# Altium schematic sheet FreidoraAireCuki.SchDoc: Freidora Aire Cuki
size A3; Author: Marianito; CompanyName: Marianito INC; DrawnBy: Marianito; Engineer: Marianito; PageSetup: Record=PageOptions|CenterHorizontal=True|CenterVertical=True|PrintScale=0.73|XCorrection=1.00|YCorrection=1.00|PrintKind=0|BorderSize=5000000|LeftOffset=0|BottomOffset=0|Orientation=2|PaperLength=1000|PaperWidth=1000|Scale=100|PaperSource=7|PrintQuality=-4|MediaType=1|DitherType=10|PrintScaleMode=1|PaperKind=A4; ProjectName: Freidora Aire Cuki
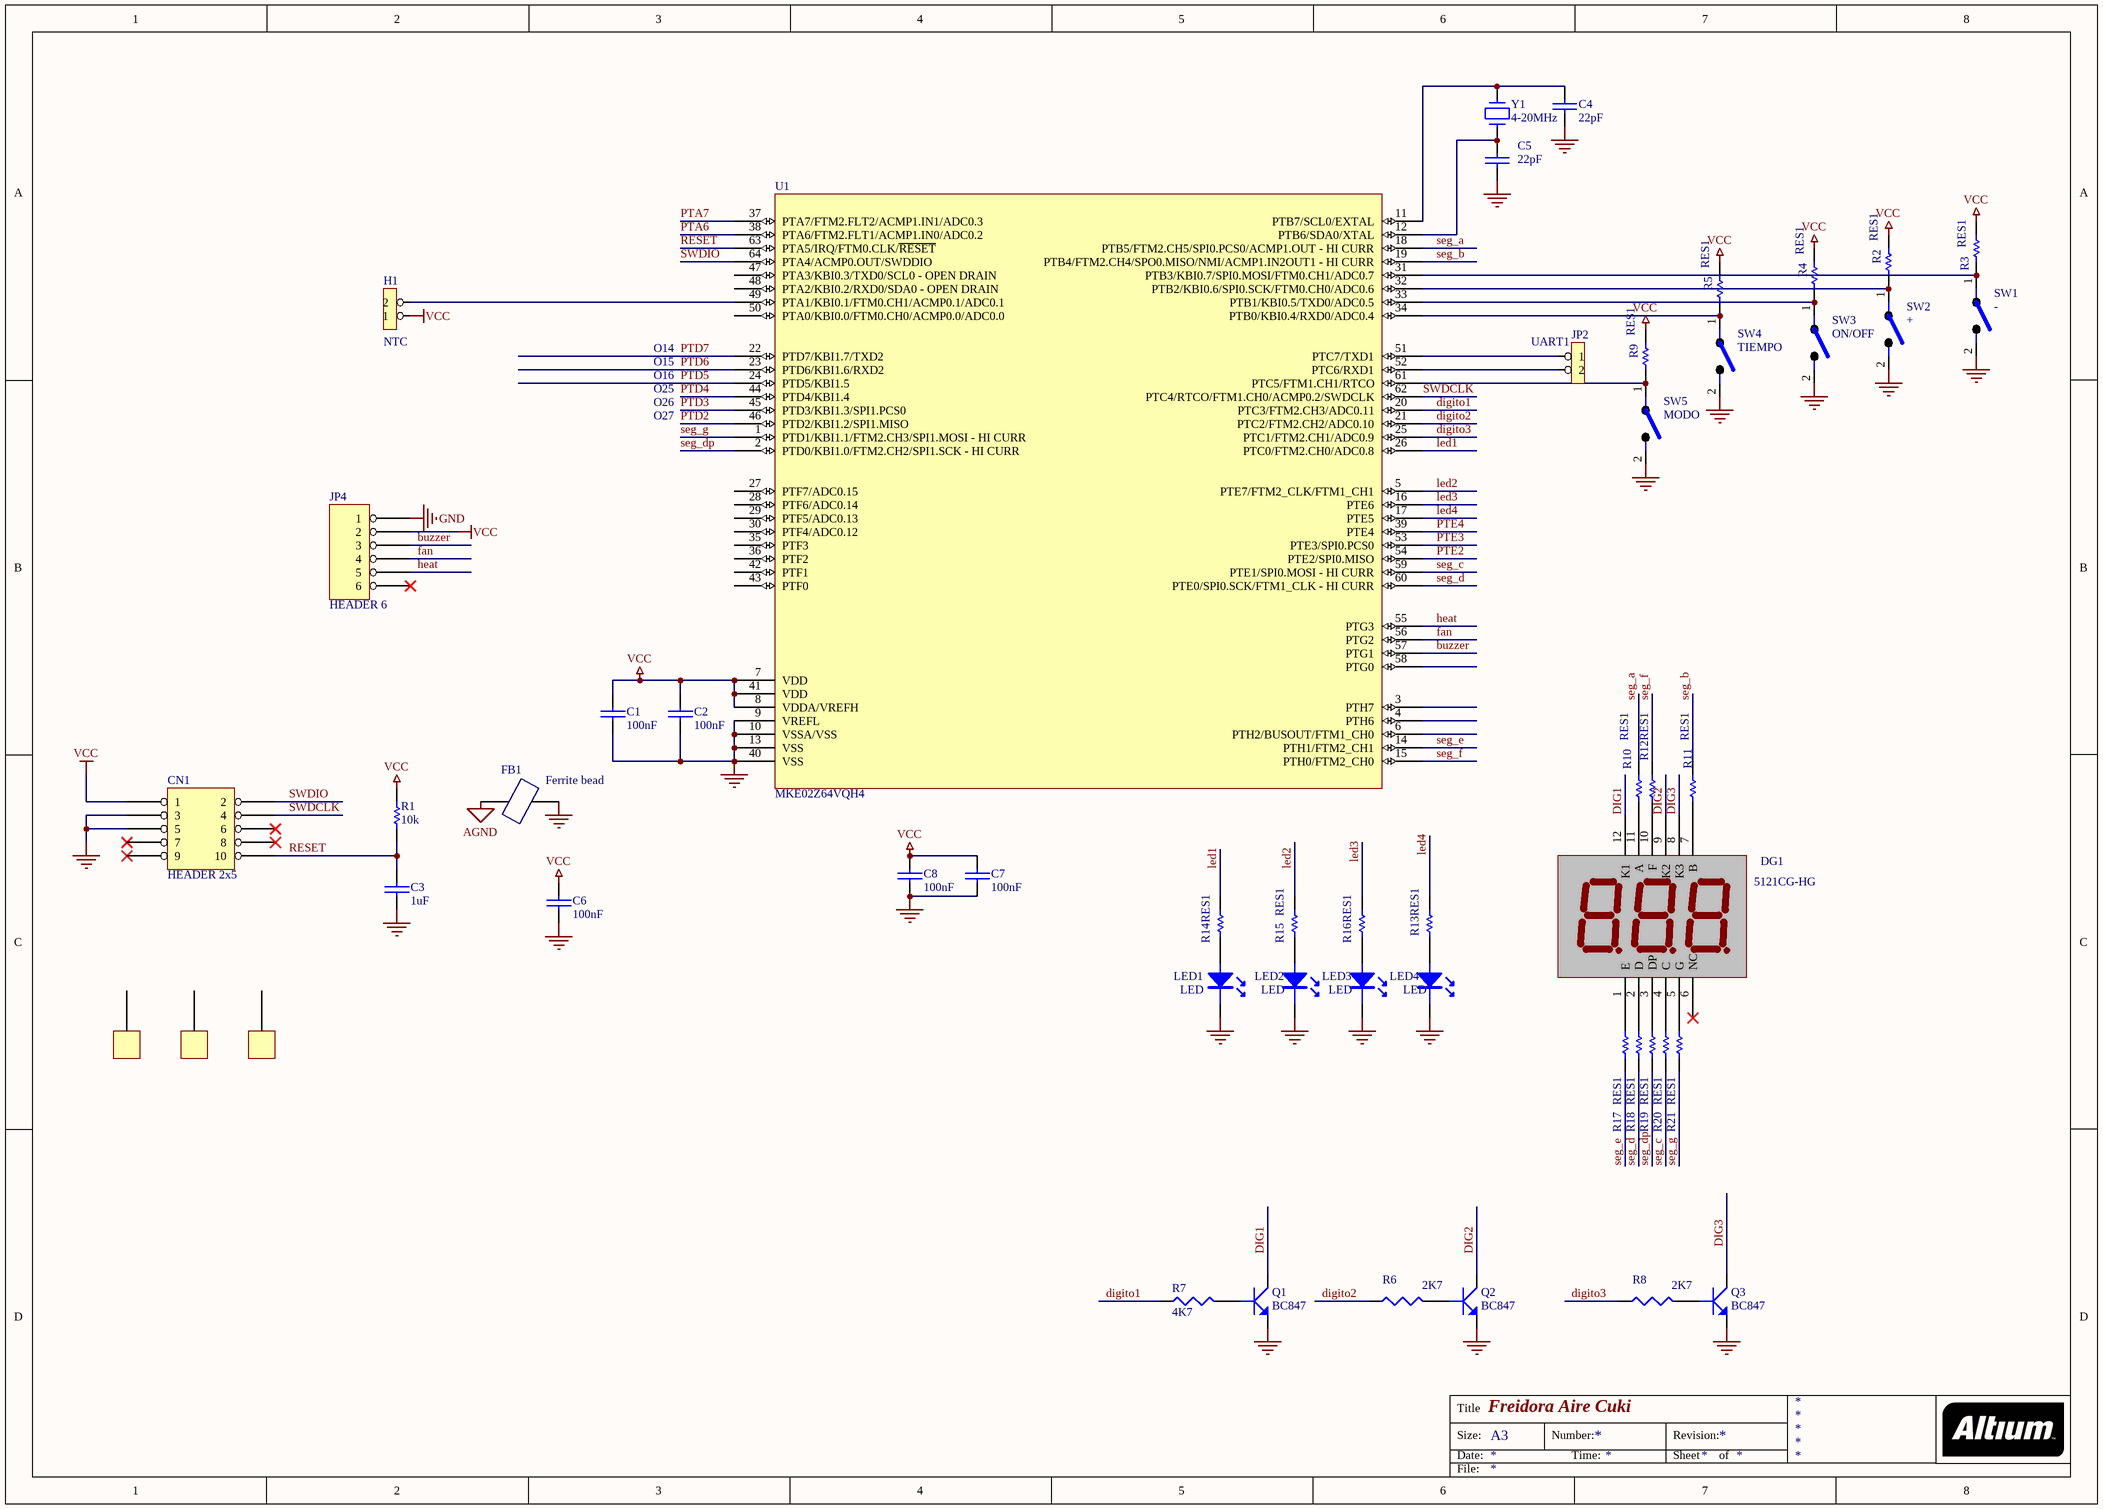
[diagram p0: FreidoraAireCuki.SchDoc]

## Parts
C1  100nF  [C-0805_N]
C2  100nF  [C-0805_N]
C3  1uF  [C-0805_N]
C4  22pF  [C-0805_N]
C5  22pF  [C-0805_N]
C6  100nF  [C-0805_N]
C7  100nF  [C-0805_N]
C8  100nF  [C-0805_N]
CN1  HEADER 2x5  [SIP2X5]
DG1  5121CG-HG  [DIGIT_3_400]
FB1  Ferrite bead  [C-0805_N]
H1  NTC  [SIP2]
JP2  UART1  [SIP2]
JP4  HEADER 6  [SIP6]
LED1  LED  [LED3MM]
LED2  LED  [LED3MM]
LED3  LED  [LED3MM]
LED4  LED  [LED3MM]
Q1  BC847  [SOT23_BOTTOM]
Q2  BC847  [SOT23_BOTTOM]
Q3  BC847  [SOT23_BOTTOM]
R1  10k  [R-0805_N_WAVE]
R2  RES1  [0805BOTTOM]
R3  RES1  [0805BOTTOM]
R4  RES1  [0805BOTTOM]
R5  RES1  [0805BOTTOM]
R6  2K7  [R-0805_N_WAVE]
R7  4K7  [R-0805_N_WAVE]
R8  2K7  [R-0805_N_WAVE]
R9  RES1  [0805BOTTOM]
R10  RES1  [0805BOTTOM]
R11  RES1  [0805BOTTOM]
R12  RES1  [0805BOTTOM]
R13  RES1  [0805BOTTOM]
R14  RES1  [0805BOTTOM]
R15  RES1  [0805BOTTOM]
R16  RES1  [0805BOTTOM]
R17  RES1  [0805BOTTOM]
R18  RES1  [0805BOTTOM]
R19  RES1  [0805BOTTOM]
R20  RES1  [0805BOTTOM]
R21  RES1  [0805BOTTOM]
SW1  -  [ZIPPY-TS]
SW2  +  [ZIPPY-TS]
SW3  ON/OFF  [ZIPPY-TS]
SW4  TIEMPO  [ZIPPY-TS]
SW5  MODO  [ZIPPY-TS]
TORR1  (no value)  [TORRETA]
TORR2  (no value)  [TORRETA]
TORR3  (no value)  [TORRETA]
U1  MKE02Z64VQH4  [QFP64]
Y1  4-20MHz  [XTAL1]

## Nets
AGND: FB1.2
GND: C1.2 C2.2 C3.2 C4.1 C5.1 C6.2 C7.2 C8.2 CN1.3 CN1.5 FB1.1 JP4.1 LED1.2(K) LED2.2(K) LED3.2(K) LED4.2(K) Q1.2(E) Q2.2(E) Q3.2(E) SW1.2 SW2.2 SW3.2 SW4.2 SW5.2 U1.9(VREFL) U1.10(VSSA/VSS) U1.13(VSS) U1.40(VSS)
VCC: C1.1 C2.1 C6.1 C7.1 C8.1 CN1.1 H1.1 JP4.2 R1.2 R2.2 R3.2 R4.2 R5.2 R9.2 U1.7(VDD) U1.8(VDDA/VREFH) U1.41(VDD)
buzzer: JP4.3 U1.57(PTG1)
DIG1: DG1.12(K1) Q1.3(C)
DIG2: DG1.9(K2) Q2.3(C)
DIG3: DG1.8(K3) Q3.3(C)
digito1: R7.1 U1.20(PTC3/FTM2.CH3/ADC0.11)
digito2: R6.1 U1.21(PTC2/FTM2.CH2/ADC0.10)
digito3: R8.1 U1.25(PTC1/FTM2.CH1/ADC0.9)
fan: JP4.4 U1.56(PTG2)
heat: JP4.5 U1.55(PTG3)
led1: R14.2 U1.26(PTC0/FTM2.CH0/ADC0.8)
led2: R15.2 U1.5(PTE7/FTM2_CLK/FTM1_CH1)
led3: R16.2 U1.16(PTE6)
led4: R13.2 U1.17(PTE5)
PTA6: U1.38(PTA6/FTM2.FLT1/ACMP1.IN0/ADC0.2)
PTA7: U1.37(PTA7/FTM2.FLT2/ACMP1.IN1/ADC0.3)
PTD2: U1.46(PTD2/KBI1.2/SPI1.MISO)
PTD3: U1.45(PTD3/KBI1.3/SPI1.PCS0)
PTD4: U1.44(PTD4/KBI1.4)
PTD5: U1.24(PTD5/KBI1.5)
PTD6: U1.23(PTD6/KBI1.6/RXD2)
PTD7: U1.22(PTD7/KBI1.7/TXD2)
PTE2: U1.54(PTE2/SPI0.MISO)
PTE3: U1.53(PTE3/SPI0.PCS0)
PTE4: U1.39(PTE4)
RESET: C3.1 CN1.10 R1.1 U1.63(PTA5/IRQ/FTM0.CLK/~{RESET})
seg_a: R10.2 U1.18(PTB5/FTM2.CH5/SPI0.PCS0/ACMP1.OUT_-_HI_CURR)
seg_b: R11.2 U1.19(PTB4/FTM2.CH4/SPO0.MISO/NMI/ACMP1.IN2OUT1_-_HI_CURR)
seg_c: R20.1 U1.59(PTE1/SPI0.MOSI_-_HI_CURR)
seg_d: R18.1 U1.60(PTE0/SPI0.SCK/FTM1_CLK_-_HI_CURR)
seg_dp: R19.1 U1.2(PTD0/KBI1.0/FTM2.CH2/SPI1.SCK_-_HI_CURR)
seg_e: R17.1 U1.14(PTH1/FTM2_CH1)
seg_f: R12.2 U1.15(PTH0/FTM2_CH0)
seg_g: R21.1 U1.1(PTD1/KBI1.1/FTM2.CH3/SPI1.MOSI_-_HI_CURR)
SWDCLK: CN1.4 U1.62(PTC4/RTCO/FTM1.CH0/ACMP0.2/SWDCLK)
SWDIO: CN1.2 U1.64(PTA4/ACMP0.OUT/SWDDIO)
NetC4_2: C4.2 U1.11(PTB7/SCL0/EXTAL) Y1.1
NetC5_2: C5.2 U1.12(PTB6/SDA0/XTAL) Y1.2
NetDG1_1: DG1.1(E) R17.2
NetDG1_2: DG1.2(D) R18.2
NetDG1_3: DG1.3(DP) R19.2
NetDG1_4: DG1.4(C) R20.2
NetDG1_5: DG1.5(G) R21.2
NetDG1_7: DG1.7(B) R11.1
NetDG1_10: DG1.10(F) R12.1
NetDG1_11: DG1.11(A) R10.1
NetH1_2: H1.2 U1.49(PTA1/KBI0.1/FTM0.CH1/ACMP0.1/ADC0.1)
NetJP2_1: JP2.1 U1.51(PTC7/TXD1)
NetJP2_2: JP2.2 U1.52(PTC6/RXD1)
NetLED1_1: LED1.1(A) R14.1
NetLED2_1: LED2.1(A) R15.1
NetLED3_1: LED3.1(A) R16.1
NetLED4_1: LED4.1(A) R13.1
NetQ1_1: Q1.1(B) R7.2
NetQ2_1: Q2.1(B) R6.2
NetQ3_1: Q3.1(B) R8.2
NetR2_1: R2.1 SW2.1 U1.32(PTB2/KBI0.6/SPI0.SCK/FTM0.CH0/ADC0.6)
NetR3_1: R3.1 SW1.1 U1.31(PTB3/KBI0.7/SPI0.MOSI/FTM0.CH1/ADC0.7)
NetR4_1: R4.1 SW3.1 U1.33(PTB1/KBI0.5/TXD0/ADC0.5)
NetR5_1: R5.1 SW4.1 U1.34(PTB0/KBI0.4/RXD0/ADC0.4)
NetR9_1: R9.1 SW5.1 U1.61(PTC5/FTM1.CH1/RTCO)

Not connected (* = marked no-connect by the designer): CN1 6* 7* 8* 9*; DG1 6(NC)*; JP4 6*; TORR1 0; TORR2 0; TORR3 0; U1 3(PTH7) 4(PTH6) 6(PTH2/BUSOUT/FTM1_CH0) 27(PTF7/ADC0.15) 28(PTF6/ADC0.14) 29(PTF5/ADC0.13) 30(PTF4/ADC0.12) 35(PTF3) 36(PTF2) 42(PTF1) 43(PTF0) 47(PTA3/KBI0.3/TXD0/SCL0_-_OPEN_DRAIN) 48(PTA2/KBI0.2/RXD0/SDA0_-_OPEN_DRAIN) 50(PTA0/KBI0.0/FTM0.CH0/ACMP0.0/ADC0.0) 58(PTG0)

## Notes on the sheet
- O14
- O15
- O16
- O25
- O26
- O27
- Title
- Size:
- Date:
- A3
- Number:
- Time:
- Revision:
- Sheet
- of
- File:

## Library data of the parts
C1 C2 C6-C8 = CAP: Non polarized capacitor; Value: 100nF
  C1 C2 C6 C8: Price: 0,022
C3-C5 = CAP: Non polarized capacitor; Value: 100nF
CN1 = HEADER 5X2
DG1 = DIGITO x 3 400: Dígito 0.52' cátodo común verde
H1 JP2 = HEADER 2: Text Field1: 0,006
LED1-LED4 = LED: Text Field1: 0,04
Q1-Q3 = BC847: NPN transistor bipolar
R1 = Res SMD 0805: Resistor SMD 0805; Precio Deksor: 0.00; Value: 1k; Published: 8-Jun-2000; LatestRevisionDate: 17-Jul-2002; LatestRevisionNote: Re-released for DXP Platform.; PackageReference: AXIAL-0.3; Publisher: Altium Limited; PackageDescription: Axial Device, Thru-Hole; 2 Leads; 0.3 in Pin Spacing
R2-R5 R9-R21 = RES1: Resistor; Value: 1K; Published: 8-Jun-2000; LatestRevisionDate: 17-Jul-2002; LatestRevisionNote: Re-released for DXP Platform.; PackageReference: AXIAL-0.3; Publisher: Altium Limited; PackageDescription: Axial Device, Thru-Hole; 2 Leads; 0.3 in Pin Spacing
R6-R8 = RES: Resistor; Text Field1: 0,012
SW1-SW5 = TECLA
TORR1-TORR3 = TORRETA
U1 = MKE02Z64VQH4: IC MCU 32BIT 64KB FLASH 64QFP; Manufacturer: Freescale Semiconductor; Core Processor: ARM® Cortex®-M0+; Core Size: 32-Bit; Speed: 40MHz; Connectivity: I²C, SPI, UART/USART; Peripherals: LVD, WDT; Number of I/O: 57; Program Memory Size: 64KB (64K x 8); EEPROM Size: 256 x 8; RAM Size: 4K x 8; Voltage - Supply (Vcc/Vdd): 2.7 V ~ 5.5 V; Data Converters: A/D 16x12b, D/A 2x6b; Oscillator Type: Internal; Supplier 1: Digi-Key; Manufacturer Part Number: MKE02Z64VQH4; RoHS: RoHS Compliant; Category: Integrated Circuits (ICs); Stock 1: 60; Packaging: Tray; Program Memory Type: FLASH; Operating Temperature: -40°C ~ 105°C; Package / Case: 64-QFP; Supplier Device Package: 64-QFP (14x14); ComponentLink1URL: http://cache.freescale.com/files/microcontrollers/doc/data_sheet/MKE02P64M40SF0.pdf; ComponentLink1Description: http://cache.freescale.com/files/microcontrollers/doc/data_sheet/MKE02P64M40SF0.pdf
Y1 = CRYSTAL